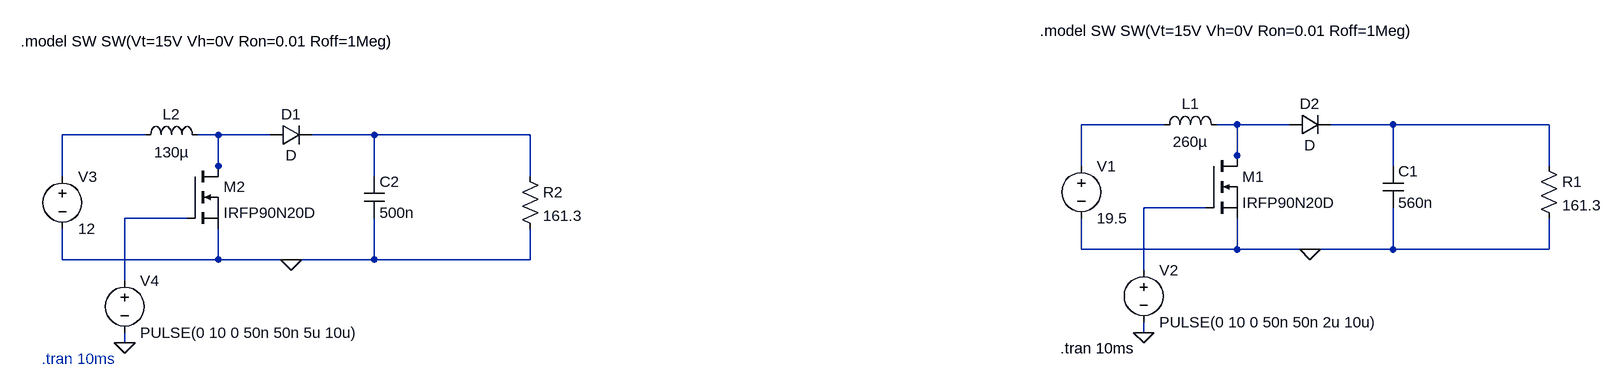
[diagram p0: schematic Examen_Sim.asc]
Examen_Sim.asc, the LTspice schematic file:
Version 4.1
SHEET 1 1208 680
WIRE 128 96 0 96
WIRE 240 96 208 96
WIRE 320 96 240 96
WIRE 480 96 384 96
WIRE 720 96 480 96
WIRE -1440 112 -1568 112
WIRE -1328 112 -1360 112
WIRE -1248 112 -1328 112
WIRE -1088 112 -1184 112
WIRE -848 112 -1088 112
WIRE 240 144 240 96
WIRE -1328 160 -1328 112
WIRE 0 160 0 96
WIRE 240 160 240 144
WIRE 480 160 480 96
WIRE 720 160 720 96
WIRE -1568 176 -1568 112
WIRE -1328 176 -1328 160
WIRE -1088 176 -1088 112
WIRE -848 176 -848 112
WIRE 192 224 96 224
WIRE -1376 240 -1472 240
WIRE 0 288 0 240
WIRE 240 288 240 240
WIRE 240 288 0 288
WIRE 352 288 240 288
WIRE 480 288 480 224
WIRE 480 288 352 288
WIRE 720 288 720 240
WIRE 720 288 480 288
WIRE -1568 304 -1568 256
WIRE -1328 304 -1328 256
WIRE -1328 304 -1568 304
WIRE -1216 304 -1328 304
WIRE -1088 304 -1088 240
WIRE -1088 304 -1216 304
WIRE -848 304 -848 256
WIRE -848 304 -1088 304
WIRE 96 320 96 224
WIRE -1472 336 -1472 240
WIRE 96 416 96 400
WIRE -1472 432 -1472 416
FLAG 352 288 0
FLAG 96 416 0
FLAG -1216 304 0
FLAG -1472 432 0
SYMBOL voltage 0 144 R0
WINDOW 123 0 0 Left 0
WINDOW 39 0 0 Left 0
SYMATTR InstName V1
SYMATTR Value 19.5
SYMBOL ind 112 112 R270
WINDOW 0 32 56 VTop 2
WINDOW 3 5 56 VBottom 2
SYMATTR InstName L1
SYMATTR Value 260µ
SYMATTR SpiceLine Rser=1m
SYMBOL cap 464 160 R0
SYMATTR InstName C1
SYMATTR Value 560n
SYMBOL res 704 144 R0
SYMATTR InstName R1
SYMATTR Value 161.3
SYMBOL voltage 96 304 R0
WINDOW 123 0 0 Left 0
WINDOW 39 0 0 Left 0
SYMATTR InstName V2
SYMATTR Value PULSE(0 10 0 50n 50n 2u 10u)
SYMBOL nmos 192 144 R0
SYMATTR InstName M1
SYMATTR Value IRFP90N20D
SYMBOL diode 320 112 R270
WINDOW 0 32 32 VTop 2
WINDOW 3 0 32 VBottom 2
SYMATTR InstName D2
SYMBOL voltage -1568 160 R0
WINDOW 123 0 0 Left 0
WINDOW 39 0 0 Left 0
SYMATTR InstName V3
SYMATTR Value 12
SYMBOL ind -1456 128 R270
WINDOW 0 32 56 VTop 2
WINDOW 3 5 56 VBottom 2
SYMATTR InstName L2
SYMATTR Value 130µ
SYMATTR SpiceLine Rser=1m
SYMBOL cap -1104 176 R0
SYMATTR InstName C2
SYMATTR Value 500n
SYMBOL res -864 160 R0
SYMATTR InstName R2
SYMATTR Value 161.3
SYMBOL voltage -1472 320 R0
WINDOW 123 0 0 Left 0
WINDOW 39 0 0 Left 0
SYMATTR InstName V4
SYMATTR Value PULSE(0 10 0 50n 50n 5u 10u)
SYMBOL nmos -1376 160 R0
SYMATTR InstName M2
SYMATTR Value IRFP90N20D
SYMBOL diode -1248 128 R270
WINDOW 0 32 32 VTop 2
WINDOW 3 0 32 VBottom 2
SYMATTR InstName D1
TEXT -32 440 Left 2 !.tran 10ms
TEXT -64 -48 Left 2 !.model SW SW(Vt=15V Vh=0V Ron=0.01 Roff=1Meg)
TEXT -1600 456 Left 2 ;.tran 10ms
TEXT -1632 -32 Left 2 !.model SW SW(Vt=15V Vh=0V Ron=0.01 Roff=1Meg)

The netlist it stands for:
* Examen_Sim.asc
V1 N001 0 19.5
L1 N001 N002 260µ Rser=1m
C1 N003 0 560n
R1 N003 0 161.3
V2 N007 0 PULSE(0 10 0 50n 50n 2u 10u)
M1 N002 N007 0 0 IRFP90N20D
D2 N002 N003 D
V3 N004 0 12
L2 N004 N005 130µ Rser=1m
C2 N006 0 500n
R2 N006 0 161.3
V4 N008 0 PULSE(0 10 0 50n 50n 5u 10u)
M2 N005 N008 0 0 IRFP90N20D
D1 N005 N006 D
.model D D
.lib standard.dio
.model NMOS NMOS
.model PMOS PMOS
.lib standard.mos
.tran 10ms
.model SW SW(Vt=15V Vh=0V Ron=0.01 Roff=1Meg)
* .tran 10ms
.model SW SW(Vt=15V Vh=0V Ron=0.01 Roff=1Meg)
.backanno
.end